# Altium schematic sheet EQ_B.SchDoc
size A4
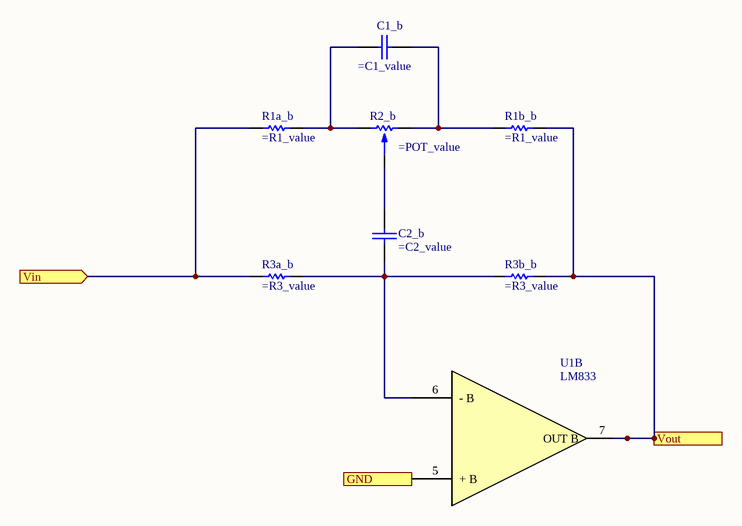
[diagram p0: EQ_B.SchDoc]

## Parts
C1_b  (no value)  [CAP200]
C2_b  (no value)  [CAP200]
R1a_b  (no value)  [0805]
R1b_b  (no value)  [0805]
R2_b  (no value)  [POTENCIOMETRO]
R3a_b  (no value)  [0805]
R3b_b  (no value)  [0805]
U1  LM833  [DIP8]  (part B of 2)

## Ports
GND, Vin (in), Vout (out)

## Nets
GND: U1.5(+_B) ; port GND
Vin: R1a_b.1 R3a_b.1 ; port Vin
Vout: R1b_b.2 R3b_b.2 U1.7(OUT_B) ; port Vout
NetC1_b_1: C1_b.1 R1a_b.2 R2_b.3
NetC1_b_2: C1_b.2 R1b_b.1 R2_b.1
NetC2_b_1: C2_b.1 R2_b.2
NetC2_b_2: C2_b.2 R3a_b.2 R3b_b.1 U1.6(-_B)

## Library data of the parts
C1_b C2_b = CAP
R1a_b R1b_b R3a_b R3b_b = RES
R2_b = POTENCIOMETRO
U1 = LM833: Dual Audio Operational Amplifier